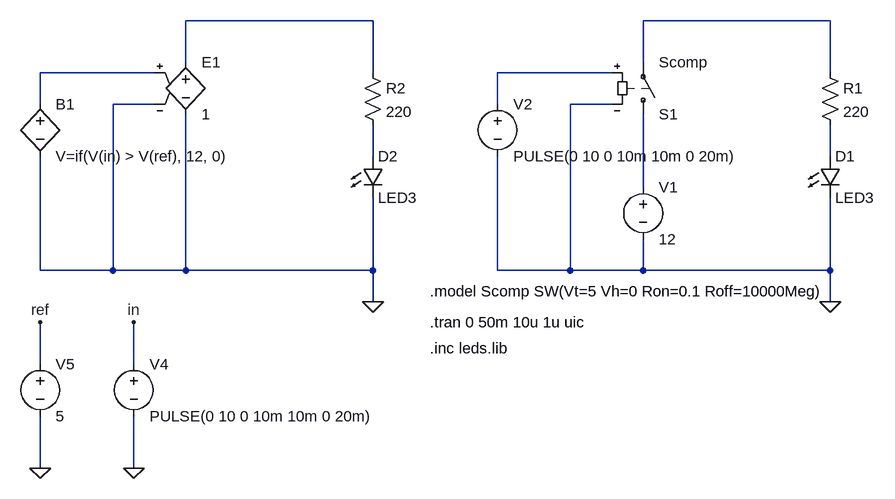
[diagram p0: schematic RELE.asc]
RELE.asc, the LTspice schematic file:
Version 4.1
SHEET 1 880 804
WIRE -208 -96 -496 -96
WIRE 496 -96 208 -96
WIRE -496 -32 -496 -96
WIRE 208 -32 208 -96
WIRE -544 -16 -720 -16
WIRE -208 -16 -208 -96
WIRE 160 -16 -16 -16
WIRE 496 -16 496 -96
WIRE -720 32 -720 -16
WIRE -544 32 -608 32
WIRE -16 32 -16 -16
WIRE 160 32 96 32
WIRE -208 112 -208 64
WIRE 496 112 496 64
WIRE 208 160 208 48
WIRE -720 288 -720 112
WIRE -608 288 -608 32
WIRE -608 288 -720 288
WIRE -496 288 -496 48
WIRE -496 288 -608 288
WIRE -208 288 -208 176
WIRE -208 288 -496 288
WIRE -16 288 -16 112
WIRE 96 288 96 32
WIRE 96 288 -16 288
WIRE 208 288 208 240
WIRE 208 288 96 288
WIRE 496 288 496 176
WIRE 496 288 208 288
WIRE -208 336 -208 288
WIRE 496 336 496 288
WIRE -720 432 -720 368
WIRE -576 432 -576 368
WIRE -720 592 -720 512
WIRE -576 592 -576 512
FLAG 496 336 0
FLAG -208 336 0
FLAG -576 592 0
FLAG -576 368 in
FLAG -720 592 0
FLAG -720 368 ref
SYMBOL voltage 208 144 R0
WINDOW 123 0 0 Left 0
WINDOW 39 0 0 Left 0
SYMATTR InstName V1
SYMATTR Value 12
SYMBOL lib\\sym\\LED 480 112 R0
SYMATTR InstName D1
SYMATTR Value LED3
SYMBOL res 480 -32 R0
SYMATTR InstName R1
SYMATTR Value 220
SYMBOL lib\\sym\\sw 208 64 M180
SYMATTR InstName S1
SYMATTR Value Scomp
SYMBOL voltage -16 16 R0
WINDOW 123 0 0 Left 0
WINDOW 39 0 0 Left 0
SYMATTR InstName V2
SYMATTR Value PULSE(0 10 0 10m 10m 0 20m)
SYMBOL lib\\sym\\bv -720 16 R0
SYMATTR InstName B1
SYMATTR Value V=if(V(in) > V(ref), 12, 0)
SYMBOL lib\\sym\\LED -224 112 R0
SYMATTR InstName D2
SYMATTR Value LED3
SYMBOL res -224 -32 R0
SYMATTR InstName R2
SYMATTR Value 220
SYMBOL lib\\sym\\e -496 -48 R0
SYMATTR InstName E1
SYMATTR Value 1
SYMBOL voltage -576 416 R0
WINDOW 123 0 0 Left 0
WINDOW 39 0 0 Left 0
SYMATTR InstName V4
SYMATTR Value PULSE(0 10 0 10m 10m 0 20m)
SYMBOL voltage -720 416 R0
WINDOW 123 0 0 Left 0
WINDOW 39 0 0 Left 0
SYMATTR InstName V5
SYMATTR Value 5
TEXT -120 320 Left 2 !.model Scomp SW(Vt=5 Vh=0 Ron=0.1 Roff=10000Meg)
TEXT -120 368 Left 2 !.tran 0 50m 10u 1u uic
TEXT -120 408 Left 2 !.inc leds.lib

The netlist it stands for:
* RELE.asc
V1 N007 0 12
D1 N006 0 LED3
R1 N002 N006 220
S1 N007 N002 N004 0 Scomp
V2 N004 0 PULSE(0 10 0 10m 10m 0 20m)
B1 N003 0 V=if(V(in) > V(ref), 12, 0)
D2 N005 0 LED3
R2 N001 N005 220
E1 N001 0 N003 0 1
V4 in 0 PULSE(0 10 0 10m 10m 0 20m)
V5 ref 0 5
.model D D
.lib standard.dio
.model Scomp SW(Vt=5 Vh=0 Ron=0.1 Roff=10000Meg)
.tran 0 50m 10u 1u uic
.inc leds.lib
.backanno
.end